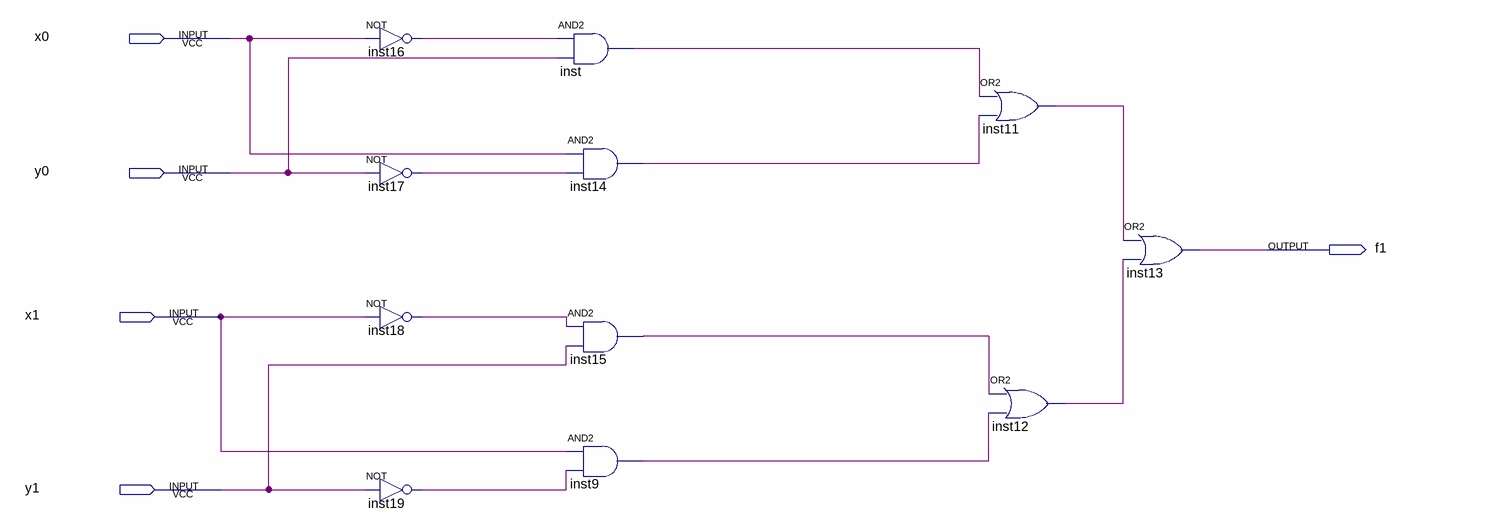
[diagram p0: schematic sheet]
// Quartus schematic lab1.bdf as structural Verilog: 11 symbols, 5 pins
module lab1 (
  input  x0,
  input  y0,
  input  x1,
  input  y1,
  output f1
);

  wire inst9_out, inst11_out, inst12_out, inst14_out, inst15_out, inst16_out, inst17_out, inst18_out,
       inst19_out, inst_out;

  not inst16 (inst16_out, x0);
  not inst17 (inst17_out, y0);
  not inst18 (inst18_out, x1);
  not inst19 (inst19_out, y1);
  and inst (inst_out, inst16_out, y0);
  and inst14 (inst14_out, x0, inst17_out);
  and inst15 (inst15_out, inst18_out, y1);
  and inst9 (inst9_out, x1, inst19_out);
  or inst11 (inst11_out, inst_out, inst14_out);
  or inst12 (inst12_out, inst15_out, inst9_out);
  or inst13 (f1, inst11_out, inst12_out);
endmodule
